# Altium schematic sheet anssipv2.SchDoc
size A
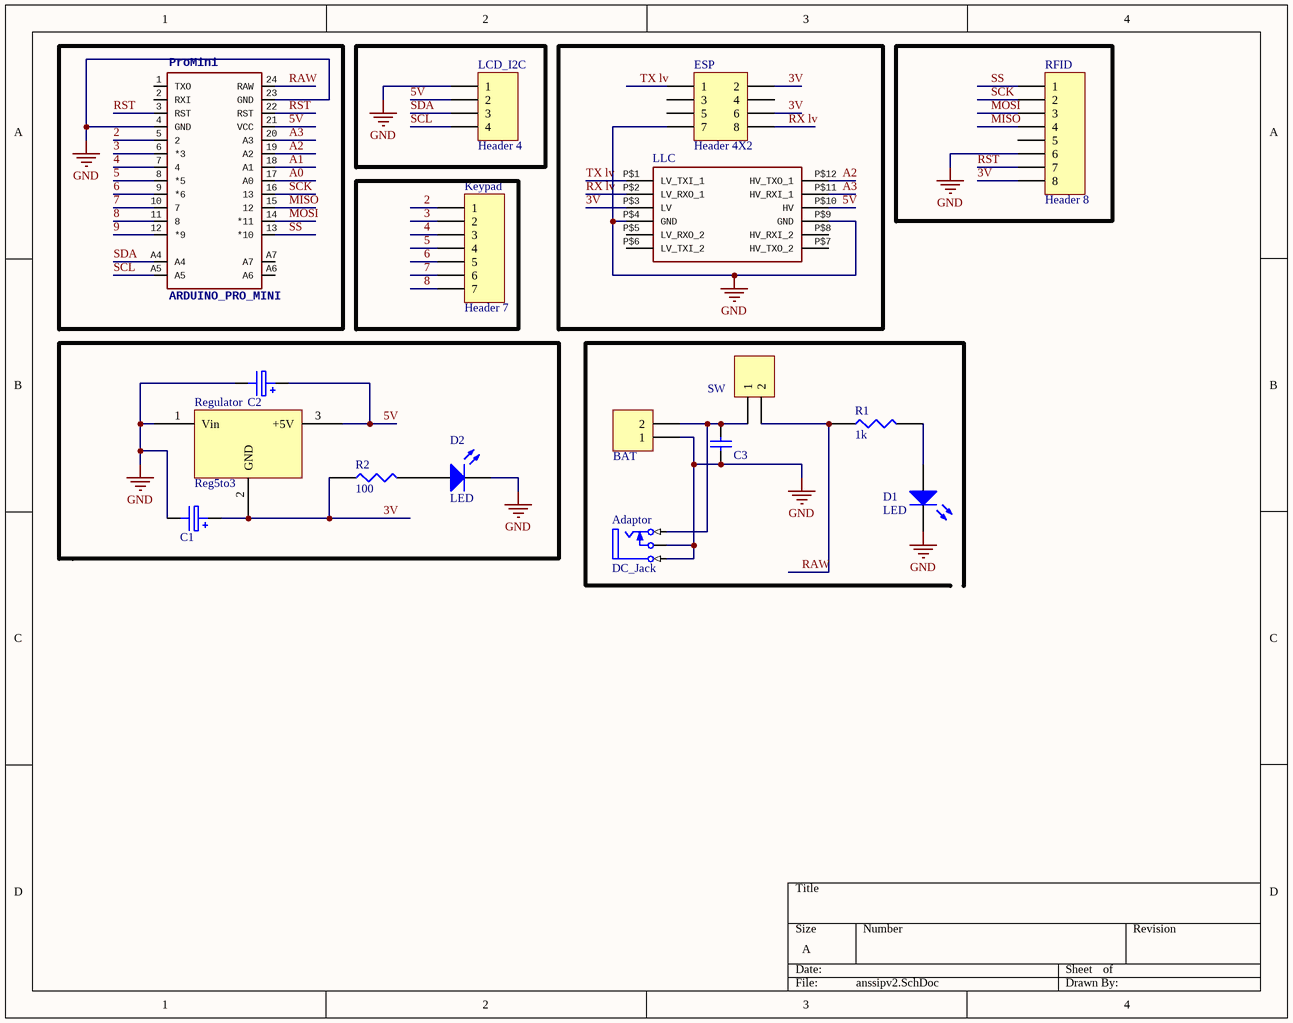
[diagram p0: anssipv2.SchDoc]

## Parts
Adaptor  DC_Jack  [My_DC_Jack]
BAT  Power Connector  [My_ Power_Connector]  (value not drawn)
C1  10uF  [CAP 2.5/6.5]  (value not drawn)
C2  10uF  [CAP 2.5/6.5]  (value not drawn)
C3  Cap  [My_cap100n]  (value not drawn)
D1  LED  [My_LED3MM]
D2  LED  [My_LED3MM]
ESP  Header 4X2  [HDR2X4]
Keypad  Header 7  [HDR1X7]
LCD_I2C  Header 4  [HDR1X4]
LLC  (no value)  [LOGIC_LEVEL_CONVERTER]
ProMini  ARDUINO_PRO_MINI  [ARDUINO_PRO_MINI]
R1  1k  [My_axial-0.4]
R2  value 100  [My_axial-0.4]  (hidden comment: 1k)
Regulator  Reg5to3  [My_TO-220]
RFID  Header 8  [HDR1X8]
SW  Power Connector  [My_ Power_Connector]  (value not drawn)

## Nets
GND: Adaptor.2(TN) Adaptor.3(S) BAT.1 C1.2 C2.2 C3.1 D1.K D2.K ESP.7 LCD_I2C.1 LLC.P$4(GND) LLC.P$9(GND) ProMini.4(GND) ProMini.23(GND) Regulator.1(Vin) RFID.6
2: Keypad.1 ProMini.5(2)
3: Keypad.2 ProMini.6(*3)
3V: C1.1 ESP.2 ESP.6 LLC.P$3(LV) R2.1 Regulator.2(GND) RFID.8
4: Keypad.3 ProMini.7(4)
5: Keypad.4 ProMini.8(*5)
5V: C2.1 LCD_I2C.2 LLC.P$10(HV) ProMini.21(VCC) Regulator.3(+5V)
6: Keypad.5 ProMini.9(*6)
7: Keypad.6 ProMini.10(7)
8: Keypad.7 ProMini.11(8)
9: ProMini.12(*9)
A0: ProMini.17(A0)
A1: ProMini.18(A1)
A2: LLC.P$12(HV_TXO_1) ProMini.19(A2)
A3: LLC.P$11(HV_RXI_1) ProMini.20(A3)
MISO: ProMini.15(12) RFID.4
MOSI: ProMini.14(*11) RFID.3
RAW: ProMini.24(RAW) R1.1 SW.2
RST: ProMini.3(RST) ProMini.22(RST) RFID.7
RX lv: ESP.8 LLC.P$2(LV_RXO_1)
SCK: ProMini.16(13) RFID.2
SCL: LCD_I2C.4 ProMini.A5
SDA: LCD_I2C.3 ProMini.A4
SS: ProMini.13(*10) RFID.1
TX lv: ESP.1 LLC.P$1(LV_TXI_1)
NetAdaptor_1: Adaptor.1(T) BAT.2 C3.2 SW.1
NetD1_A: D1.A R1.2
NetD2_A: D2.A R2.2

Not connected (* = marked no-connect by the designer): ESP 3 4 5; LLC P$5(LV_RXO_2) P$6(LV_TXI_2) P$7(HV_TXO_2) P$8(HV_RXI_2); ProMini 1(TXO) 2(RXI) A6 A7; RFID 5

## Library data of the parts
Adaptor = DC_Jack: PackageDocument: 2003; PCB_Layout: Complies with manufacturer's recommendation.; DrillAndSlotSize: Corresponds to nominal value.; LatestRevisionDate: 15-Jul-2004; LatestRevisionNote: Component Replaced & renamed from "Phonejack".; DatasheetDocument: 2003; PackageReference: S1VS_SNB; Publisher: Altium Limited; ComponentLink1Description: Manufacturer Link; ComponentLink1URL: http://www.cliffuk.co.uk/
BAT SW = Power Connector: white Power Connector
C1 C2 = CAP2: Electrolytic Capacitor
C3 = Cap ceramic: CAP-100Nf; Value: 100nF
D1 D2 = LED: Typical INFRARED GaAs LED; Published: 8-Jun-2000; LatestRevisionDate: 08-Jul-2005; LatestRevisionNote: Mech Layer 1 removed.; Publisher: Altium Limited
ESP = Header 4X2: Header, 4-Pin, Dual row; LatestRevisionDate: 17-Jul-2002; LatestRevisionNote: Re-released for DXP Platform.; Publisher: Altium Limited
Keypad = Header 7: Header, 7-Pin; LatestRevisionDate: 17-Jul-2002; LatestRevisionNote: Re-released for DXP Platform.; Publisher: Altium Limited
LCD_I2C = Header 4: Header, 4-Pin; LatestRevisionDate: 17-Jul-2002; LatestRevisionNote: Re-released for DXP Platform.; Publisher: Altium Limited
LLC = LOGIC_LEVEL_CONVERTER
R1 R2 = Res: resistor 1/4 wat
  R1: Value: 1k
Regulator = 7805: Regulator
RFID = Header 8: Header, 8-Pin; LatestRevisionDate: 17-Jul-2002; LatestRevisionNote: Re-released for DXP Platform.; Publisher: Altium Limited